# Altium schematic sheet CAN.SchDoc
size A; SheetNumber: 6; SheetTotal: 6
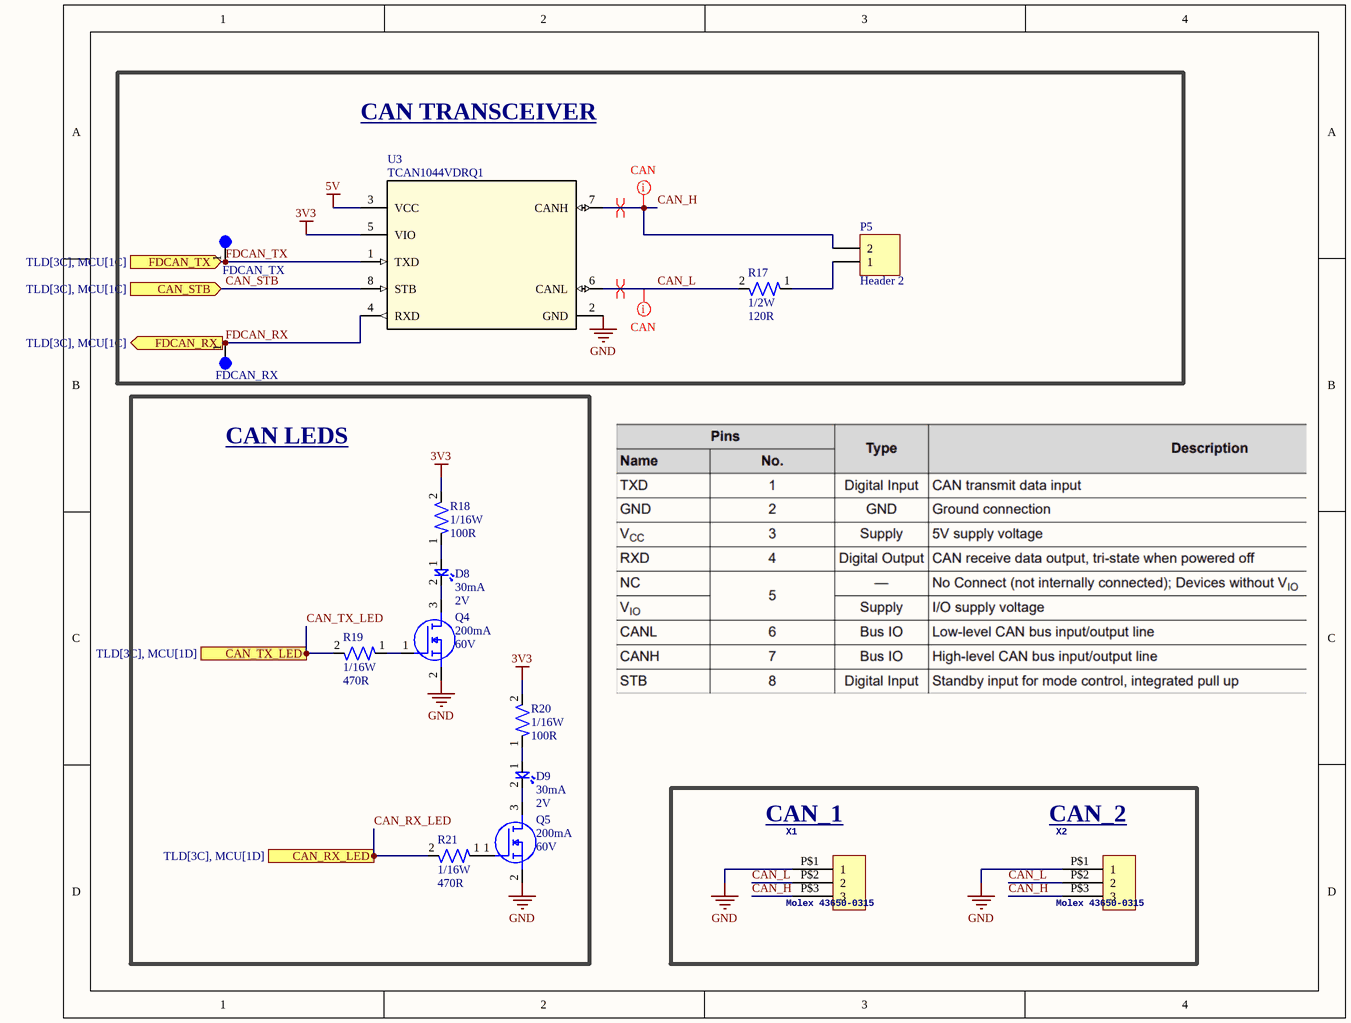
[diagram p0: CAN.SchDoc]

## Parts
D8  Forward Current: 30mA  Forward Voltage: 2V  [LED-0603]  (hidden comment: BL-HKC36G-AV-TRB)
D9  Forward Current: 30mA  Forward Voltage: 2V  [LED-0603]  (hidden comment: BL-HKC36G-AV-TRB)
FDCAN_RX  5003  [TEST-POINT-0001]  (value not drawn)
FDCAN_TX  5003  [TEST-POINT-0001]  (value not drawn)
P5  Header 2  [HDR1X2]
Q4  Continuous Current: 200mA  Voltage: 60V  [IC-SOT23-3]  (hidden comment: T2N7002AK,LM)
Q5  Continuous Current: 200mA  Voltage: 60V  [IC-SOT23-3]  (hidden comment: T2N7002AK,LM)
R17  Power: 1/2W  Resistance: 120R  [RES-1210]  (hidden comment: RC1210FR-07120RL)
R18  Power: 1/16W  Resistance: 100R  [RES-0402]  (hidden comment: RC0402FR-07100RL)
R19  Power: 1/16W  Resistance: 470R  [RES-0402]  (hidden comment: RC0402FR-07470RL)
R20  Power: 1/16W  Resistance: 100R  [RES-0402]  (hidden comment: RC0402FR-07100RL)
R21  Power: 1/16W  Resistance: 470R  [RES-0402]  (hidden comment: RC0402FR-07470RL)
U3  TCAN1044VDRQ1  [IC-8SOIC]
X1  Molex 43650-0315  [43650-0315]
X2  Molex 43650-0315  [43650-0315]

## Blocks framed on the sheet
CAN TRANSCEIVER: FDCAN_RX FDCAN_TX P5 R17 U3
CAN LEDS: D8 D9 Q4 Q5 R18-R21

## Ports
CAN_RX_LED (in, see TLD[3C], MCU[1D]), CAN_STB (in, see TLD[3C], MCU[1C]), CAN_TX_LED (in, see TLD[3C], MCU[1D]), FDCAN_RX (out, see TLD[3C], MCU[1C]), FDCAN_TX (in, see TLD[3C], MCU[1C])

## Nets
3V3: R18.2 R20.2 U3.5(VIO)
5V: U3.3(VCC)
GND: Q4.2(S) Q5.2(S) U3.2(GND) X1.P$1(1) X2.P$1(1)
CAN_H: P5.2 U3.7(CANH) X1.P$3(3) X2.P$3(3)
CAN_L: R17.2 U3.6(CANL) X1.P$2(2) X2.P$2(2)
CAN_RX_LED: R21.2 ; port CAN_RX_LED
CAN_STB: U3.8(STB) ; port CAN_STB
CAN_TX_LED: R19.2 ; port CAN_TX_LED
FDCAN_RX: FDCAN_RX.1 U3.4(RXD) ; port FDCAN_RX
FDCAN_TX: FDCAN_TX.1 U3.1(TXD) ; port FDCAN_TX
NetD8_1: D8.1 R18.1
NetD8_2: D8.2 Q4.3(D)
NetD9_1: D9.1 R20.1
NetD9_2: D9.2 Q5.3(D)
NetP5_1: P5.1 R17.1
NetQ4_1: Q4.1(G) R19.1
NetQ5_1: Q5.1(G) R21.1

## Layout directives
differential pair; differential pair class CAN: CAN_H, CAN_L
mark named CAN: CAN_H, CAN_L

## Notes on the sheet
- (near X1) CAN_1
- (near X2) CAN_2

## Library data of the parts
D8 D9 = LED-0001: LED YELLOW CLEAR 0603 SMD; ComponentLink1Description: Datasheet; ComponentLink1URL: https://www.americanbrightled.com/pdffiles/led-components/smt/BL-HKC36G-AV-TRB.pdf
FDCAN_RX FDCAN_TX = TEST-POINT-0001: Oranange PC Test Point, Miniature Phoisphor Bronze Silver Plating Through Hole Mounting Type
P5 = Header 2: Header, 2-Pin; LatestRevisionDate: 17-Jul-2002; LatestRevisionNote: Re-released for DXP Platform.; Publisher: Altium Limited
Q4 Q5 = NMOS-200MA-0001: MOSFET N-CH 60V 200MA SOT23; ComponentLink1Description: Datasheet; ComponentLink1URL: https://toshiba.semicon-storage.com/info/T2N7002AK_datasheet_en_20150401.pdf?did=29712&prodName=T2N7002AK
R17 = RES-120-0001: RES 120 OHM 1% 1/2W 1210; Tolerance: 1%; Size: 1210; ComponentLink1Description: Datasheet; ComponentLink1URL: https://www.yageo.com/upload/media/product/products/datasheet/rchip/PYu-RC_Group_51_RoHS_L_12.pdf
R18 R20 = RES-100-0001: RES 100 OHM 1% 1/16W 0402; Tolerance: 1%; Size: 0402; ComponentLink1Description: Datasheet; ComponentLink1URL: https://www.yageo.com/upload/media/product/products/datasheet/rchip/PYu-RC_Group_51_RoHS_L_12.pdf
R19 R21 = RES-470-0001: RES 470 OHM 1% 1/16W 0402; Tolerance: 1%; Size: 0402; ComponentLink1Description: Datasheet; ComponentLink1URL: https://www.yageo.com/upload/media/product/products/datasheet/rchip/PYu-RC_Group_51_RoHS_L_12.pdf
U3 = IC-CAN-0001: IC TRANSCEIVER 1/1 8SOIC; ComponentLink1Description: Datasheet; ComponentLink1URL: https://www.ti.com/lit/ds/symlink/tcan1044-q1.pdf?HQS=dis-dk-null-digikeymode-dsf-pf-null-wwe&ts=1728758303289&ref_url=https%253A%252F%252Fwww.ti.com%252Fgeneral%252Fdocs%252Fsuppproductinfo.tsp%253FdistId%253D10%2526gotoUrl%253Dhttps%253A%252F%252Fwww.ti.com%252Flit%252Fgpn%252Ftcan1044-q1
X1 X2 = Micro-Fit Molex 3 Pin Vertical: GateName_1: G$1; SymbolName_1: HEADER_POS3; DeviceSetName: HEADER_POS3_?; DeviceName: 43650-0315; LibraryName: con-molex-micro-fit-3_0_2; Package: 43650-0315